# Altium schematic sheet Analog Front End.SchDoc
size A1
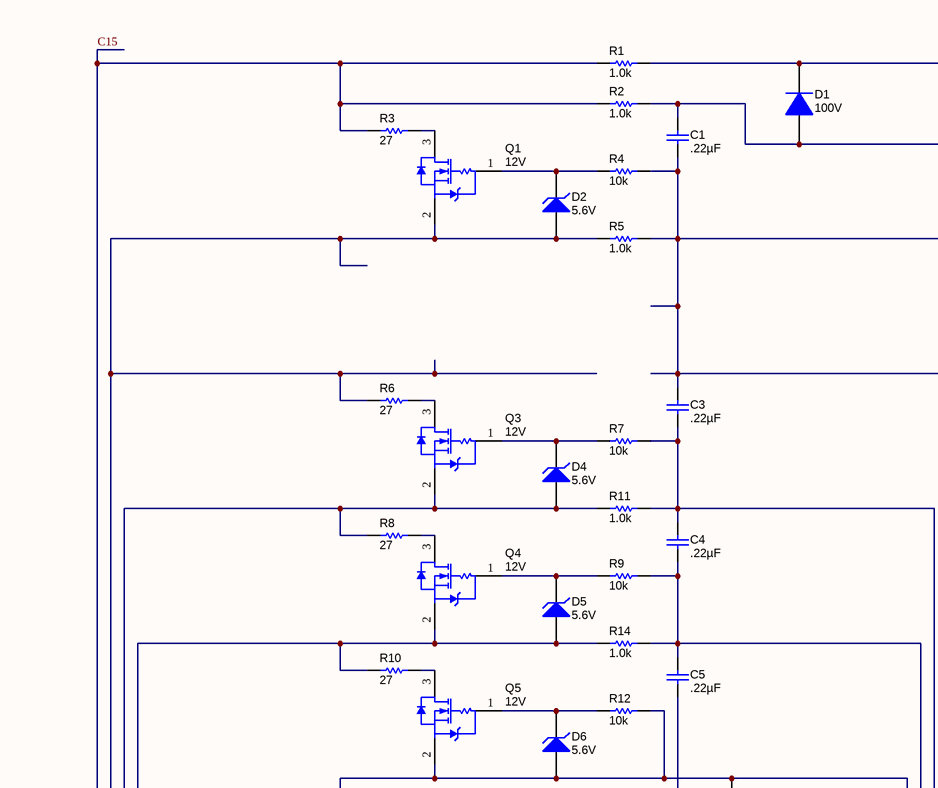
[diagram p0: Analog Front End.SchDoc, top left]
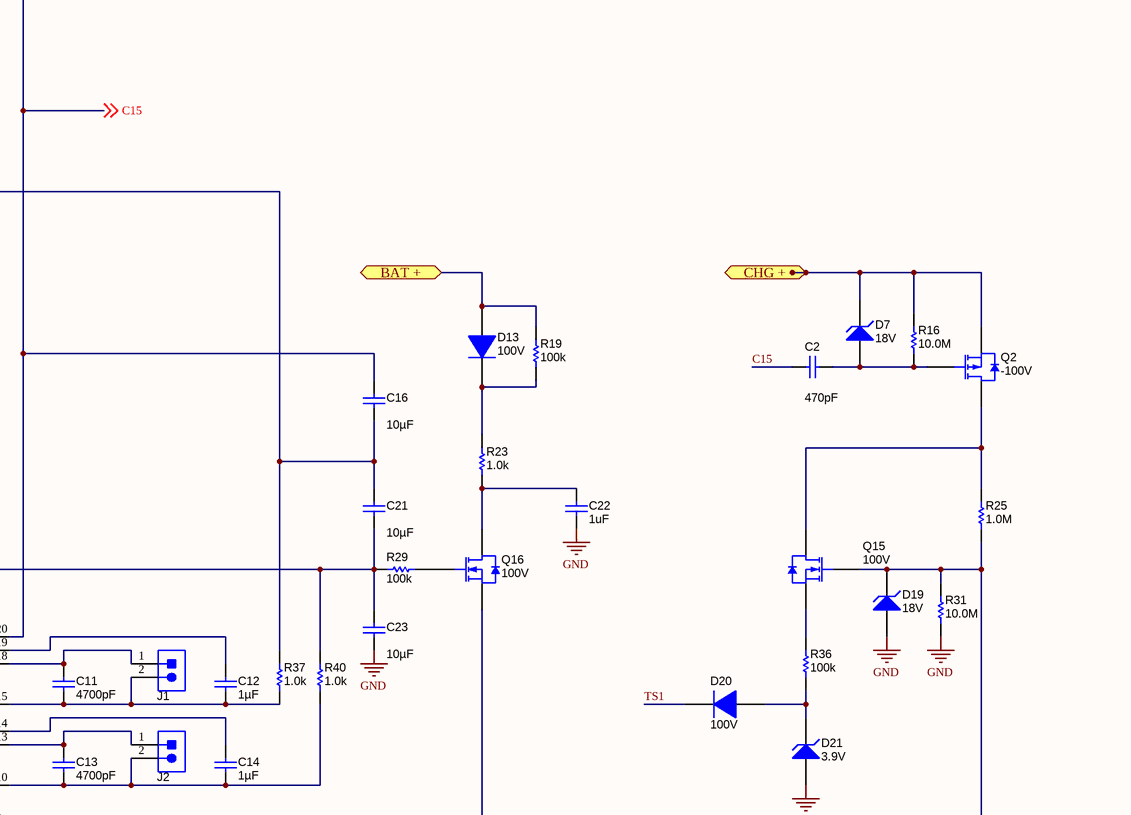
[diagram p1: Analog Front End.SchDoc, top right]
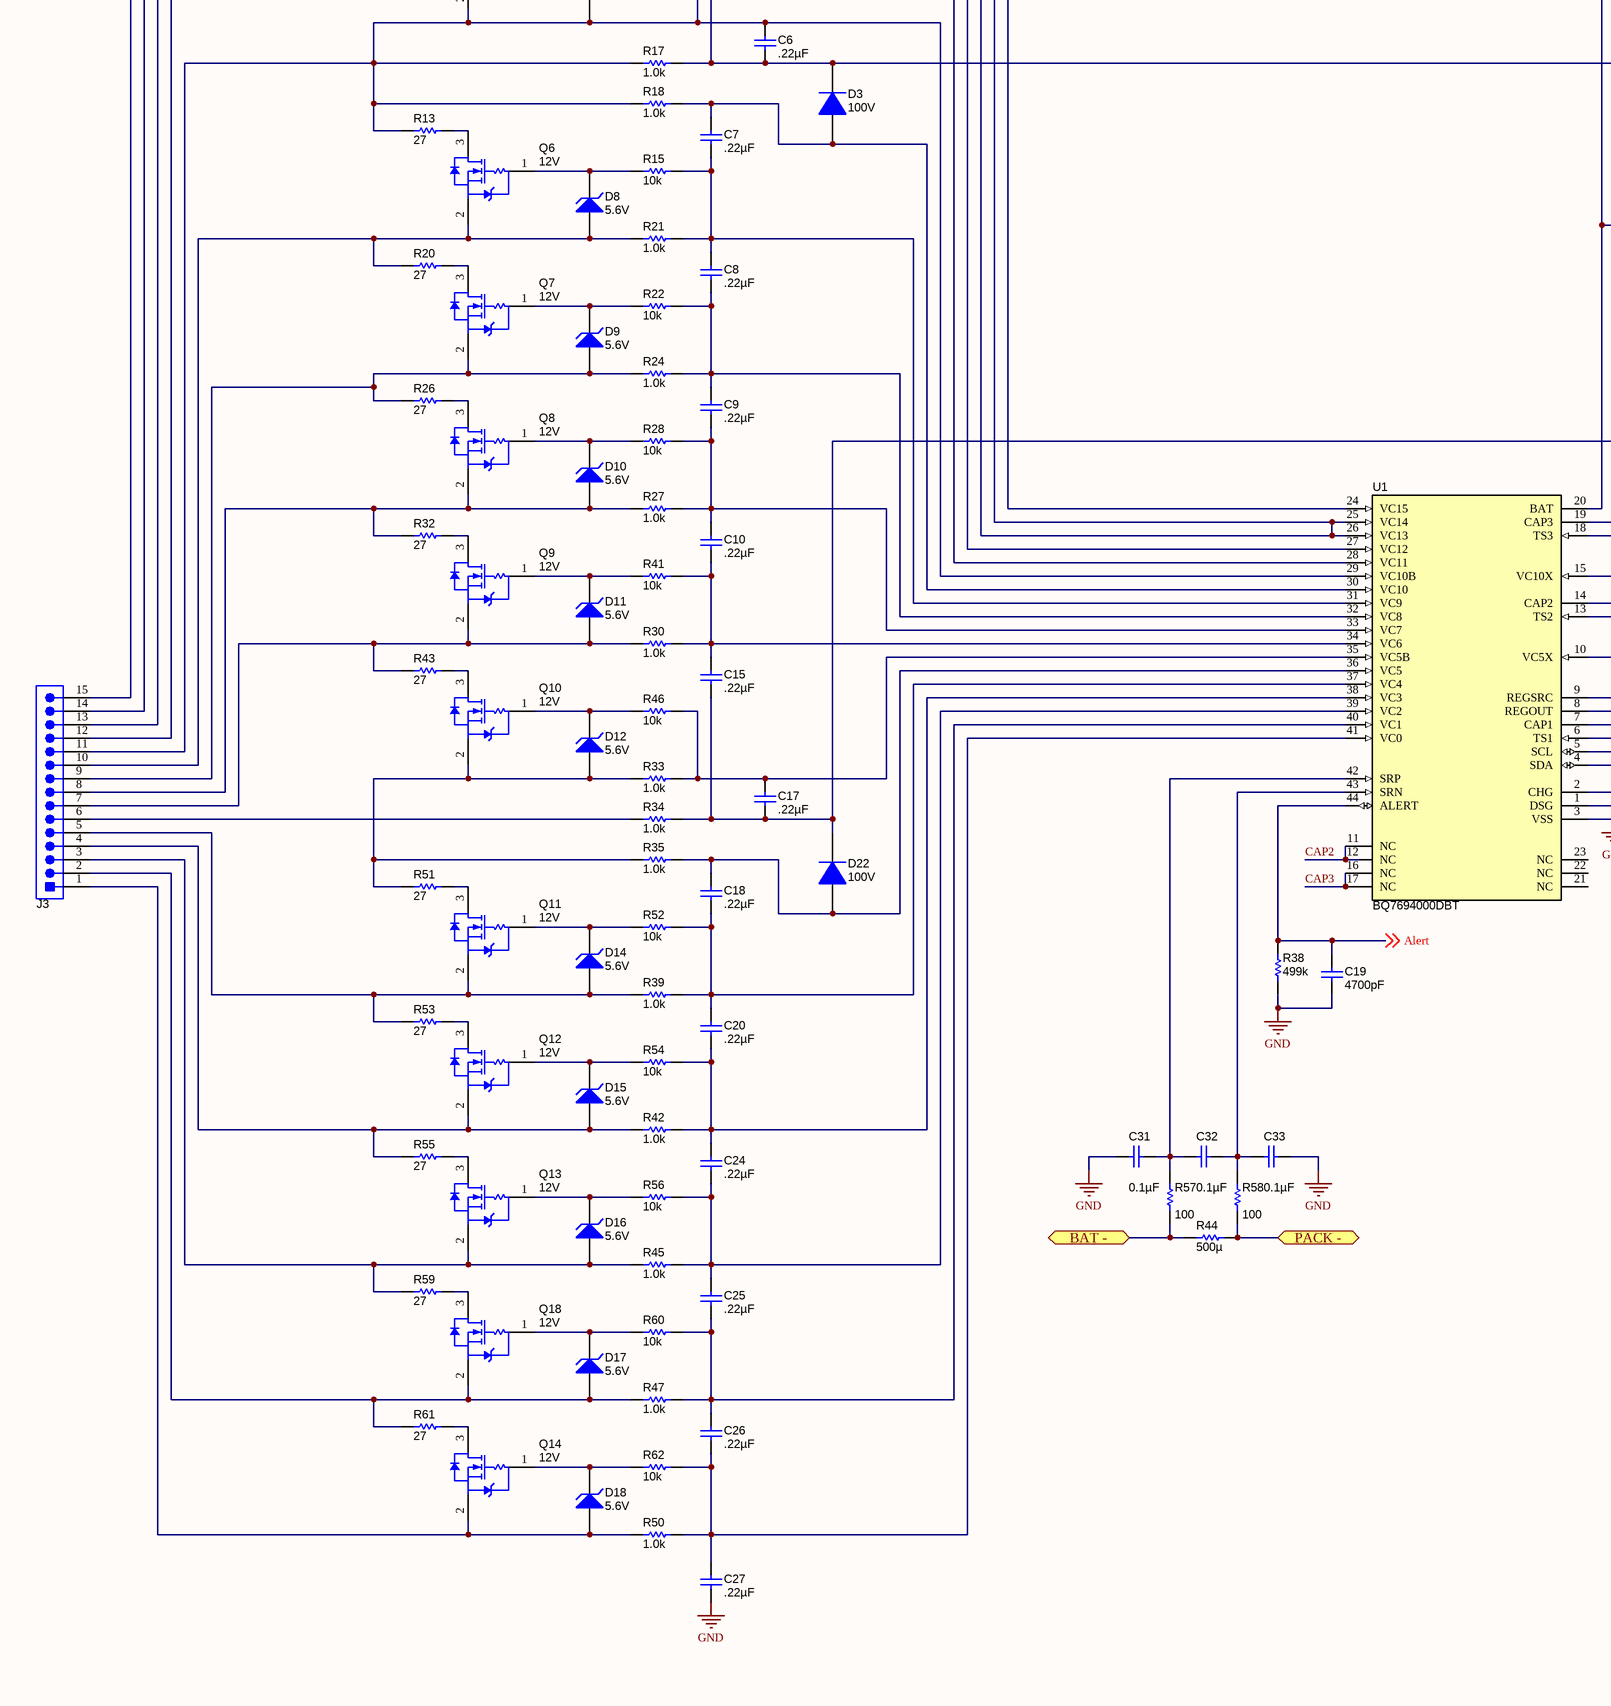
[diagram p2: Analog Front End.SchDoc, bottom left]
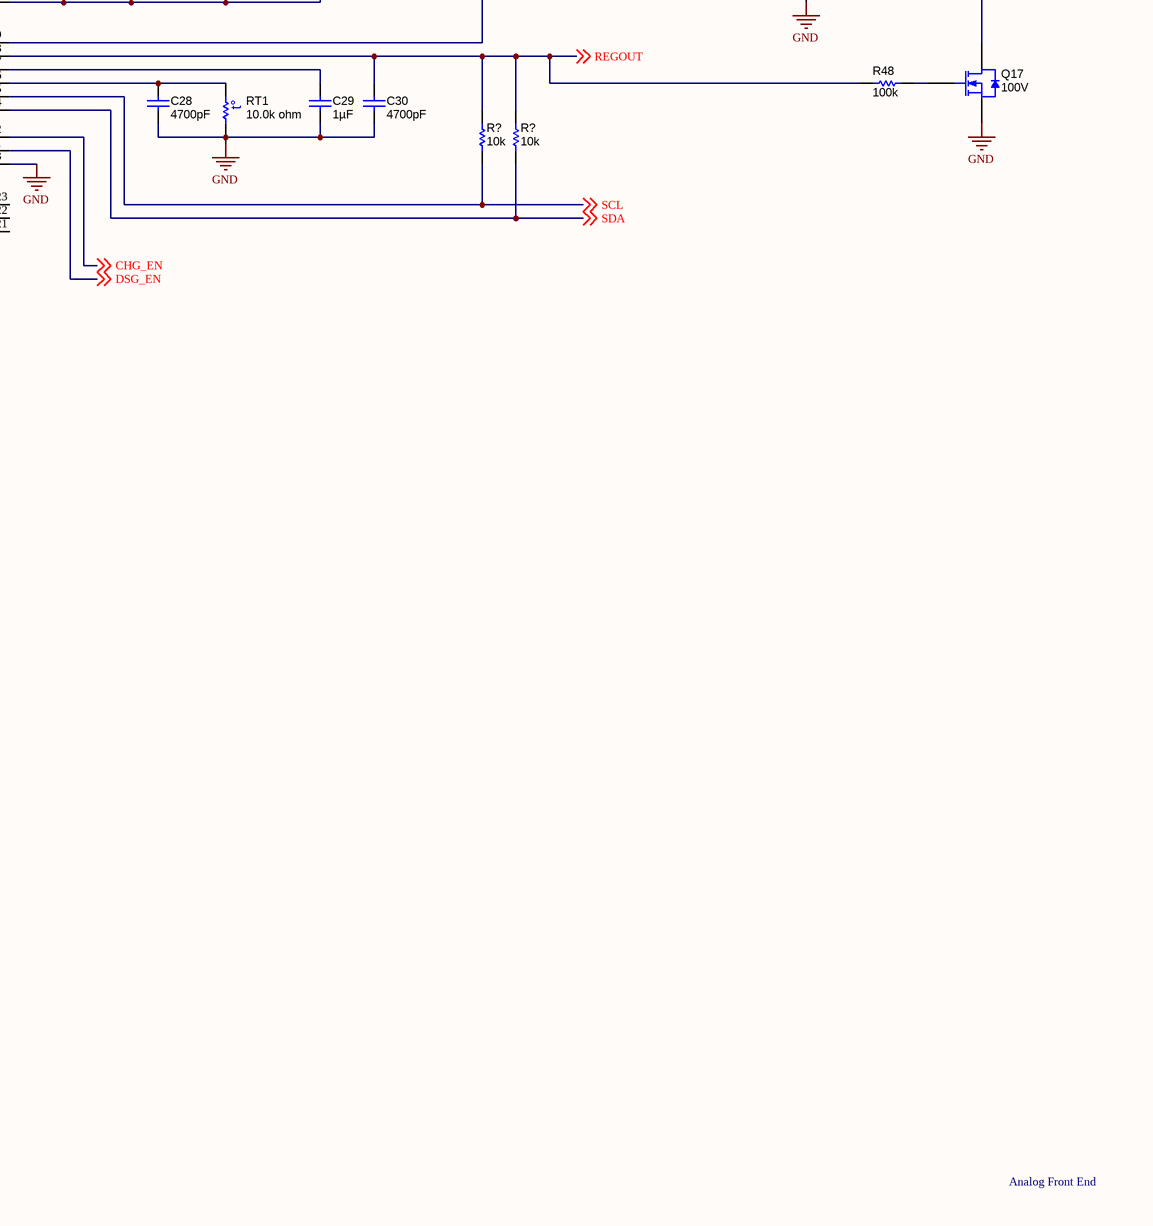
[diagram p3: Analog Front End.SchDoc, bottom right]

## Parts
(Parts that share a designator on the sheet are numbered #1, #2 ... from top to bottom, then left to right.)
C1  ValueDisplayed: .22µF  [CAP 0603/1608]  (hidden comment: CL10B224KA8NNNC)
C2  ValueDisplayed: 470pF  [CAP 0603/1608]  (hidden comment: CL10B471KB8WPNC)
C3  ValueDisplayed: .22µF  [CAP 0603/1608]  (hidden comment: CL10B224KA8NNNC)
C4  ValueDisplayed: .22µF  [CAP 0603/1608]  (hidden comment: CL10B224KA8NNNC)
C5  ValueDisplayed: .22µF  [CAP 0603/1608]  (hidden comment: CL10B224KA8NNNC)
C6  ValueDisplayed: .22µF  [CAP 0603/1608]  (hidden comment: CL10B224KA8NNNC)
C7  ValueDisplayed: .22µF  [CAP 0603/1608]  (hidden comment: CL10B224KA8NNNC)
C8  ValueDisplayed: .22µF  [CAP 0603/1608]  (hidden comment: CL10B224KA8NNNC)
C9  ValueDisplayed: .22µF  [CAP 0603/1608]  (hidden comment: CL10B224KA8NNNC)
C10  ValueDisplayed: .22µF  [CAP 0603/1608]  (hidden comment: CL10B224KA8NNNC)
C11  ValueDisplayed: 4700pF  [0603]  (hidden comment: 885012206087)
C12  ValueDisplayed: 1µF  [CAP 0603/1608]  (hidden comment: CL10B105KA8NNNC)
C13  ValueDisplayed: 4700pF  [0603]  (hidden comment: 885012206087)
C14  ValueDisplayed: 1µF  [CAP 0603/1608]  (hidden comment: CL10B105KA8NNNC)
C15  ValueDisplayed: .22µF  [CAP 0603/1608]  (hidden comment: CL10B224KA8NNNC)
C16  ValueDisplayed: 10µF  [CAP 1206/3216 - 1.8MM]  (hidden comment: CGA5L1X7R1V106K160AC)
C17  ValueDisplayed: .22µF  [CAP 0603/1608]  (hidden comment: CL10B224KA8NNNC)
C18  ValueDisplayed: .22µF  [CAP 0603/1608]  (hidden comment: CL10B224KA8NNNC)
C19  ValueDisplayed: 4700pF  [0603]  (hidden comment: 885012206087)
C20  ValueDisplayed: .22µF  [CAP 0603/1608]  (hidden comment: CL10B224KA8NNNC)
C21  ValueDisplayed: 10µF  [CAP 1206/3216 - 1.8MM]  (hidden comment: CGA5L1X7R1V106K160AC)
C22  ValueDisplayed: 1uF  [CAP 0603/1608]  (hidden comment: CL10B105KA8NNNC)
C23  ValueDisplayed: 10µF  [CAP 1206/3216 - 1.8MM]  (hidden comment: CGA5L1X7R1V106K160AC)
C24  ValueDisplayed: .22µF  [CAP 0603/1608]  (hidden comment: CL10B224KA8NNNC)
C25  ValueDisplayed: .22µF  [CAP 0603/1608]  (hidden comment: CL10B224KA8NNNC)
C26  ValueDisplayed: .22µF  [CAP 0603/1608]  (hidden comment: CL10B224KA8NNNC)
C27  ValueDisplayed: .22µF  [CAP 0603/1608]  (hidden comment: CL10B224KA8NNNC)
C28  ValueDisplayed: 4700pF  [CAP 0603/1608]  (hidden comment: CL10B472KC8WPNC)
C29  ValueDisplayed: 1µF  [CAP 0603/1608]  (hidden comment: CL10B105KA8NNNC)
C30  ValueDisplayed: 4700pF  [CAP 0603/1608]  (hidden comment: CL10B472KC8WPNC)
C31  ValueDisplayed: 0.1µF  [CAP 0603/1608]  (hidden comment: C1608X7R1H104K080AA)
C32  ValueDisplayed: 0.1µF  [CAP 0603/1608]  (hidden comment: C1608X7R1H104K080AA)
C33  ValueDisplayed: 0.1µF  [CAP 0603/1608]  (hidden comment: C1608X7R1H104K080AA)
D1  value 100V  [SOD123FA]  (hidden comment: S210FA)
D2  value 5.6V  [SOD323FL]  (hidden comment: MM3Z5V6C)
D3  value 100V  [SOD123FA]  (hidden comment: S210FA)
D4  value 5.6V  [SOD323FL]  (hidden comment: MM3Z5V6C)
D5  value 5.6V  [SOD323FL]  (hidden comment: MM3Z5V6C)
D6  value 5.6V  [SOD323FL]  (hidden comment: MM3Z5V6C)
D7  value 18V  [SOD-123]  (hidden comment: BZT52C18-E3-08)
D8  value 5.6V  [SOD323FL]  (hidden comment: MM3Z5V6C)
D9  value 5.6V  [SOD323FL]  (hidden comment: MM3Z5V6C)
D10  value 5.6V  [SOD323FL]  (hidden comment: MM3Z5V6C)
D11  value 5.6V  [SOD323FL]  (hidden comment: MM3Z5V6C)
D12  value 5.6V  [SOD323FL]  (hidden comment: MM3Z5V6C)
D13  value 100V  [SOD123FA]  (hidden comment: S210FA)
D14  value 5.6V  [SOD323FL]  (hidden comment: MM3Z5V6C)
D15  value 5.6V  [SOD323FL]  (hidden comment: MM3Z5V6C)
D16  value 5.6V  [SOD323FL]  (hidden comment: MM3Z5V6C)
D17  value 5.6V  [SOD323FL]  (hidden comment: MM3Z5V6C)
D18  value 5.6V  [SOD323FL]  (hidden comment: MM3Z5V6C)
D19  value 18V  [SOD-123]  (hidden comment: BZT52C18-E3-08)
D20  value 100V  [SOD123FA]  (hidden comment: S210FA)
D21  value 3.9V  [SOD323F]  (hidden comment: MM3Z3V9B)
D22  value 100V  [SOD123FA]  (hidden comment: S210FA)
J1  SWR25X-NRTC-S02-ST-BA  [SULLINS NRTC-S02]  (value not drawn)
J2  SWR25X-NRTC-S02-ST-BA  [SULLINS NRTC-S02]  (value not drawn)
J3  S15B-PH-SM4-TB(LF)(SN)  [JST S15B-PH-SM4-TB]  (value not drawn)
Q1  value 12V  [Femto (0402)]  (hidden comment: CSD13381F4)
Q2  value -100V  [SOT223]  (hidden comment: FQT5P10TF)
Q3  value 12V  [Femto (0402)]  (hidden comment: CSD13381F4)
Q4  value 12V  [Femto (0402)]  (hidden comment: CSD13381F4)
Q5  value 12V  [Femto (0402)]  (hidden comment: CSD13381F4)
Q6  value 12V  [Femto (0402)]  (hidden comment: CSD13381F4)
Q7  value 12V  [Femto (0402)]  (hidden comment: CSD13381F4)
Q8  value 12V  [Femto (0402)]  (hidden comment: CSD13381F4)
Q9  value 12V  [Femto (0402)]  (hidden comment: CSD13381F4)
Q10  value 12V  [Femto (0402)]  (hidden comment: CSD13381F4)
Q11  value 12V  [Femto (0402)]  (hidden comment: CSD13381F4)
Q12  value 12V  [Femto (0402)]  (hidden comment: CSD13381F4)
Q13  value 12V  [Femto (0402)]  (hidden comment: CSD13381F4)
Q14  value 12V  [Femto (0402)]  (hidden comment: CSD13381F4)
Q15  value 100V  [SOT323]  (hidden comment: BSS123WQ-7-FDICT-ND)
Q16  value 100V  [SOT323]  (hidden comment: BSS123WQ-7-FDICT-ND)
Q17  value 100V  [SOT323]  (hidden comment: BSS123WQ-7-FDICT-ND)
Q18  value 12V  [Femto (0402)]  (hidden comment: CSD13381F4)
R1  ValueDisplayed: 1.0k  [RES 0603/1608]  (hidden comment: ERJ-PB3D1001V)
R2  ValueDisplayed: 1.0k  [RES 0603/1608]  (hidden comment: ERJ-PB3D1001V)
R3  ValueDisplayed: 27  [RES 1206/3216]  (hidden comment: LTR18EZPF27R0)
R4  ValueDisplayed: 10k  [RES 0603/1608]  (hidden comment: ERJ-3EKF1002V)
R5  ValueDisplayed: 1.0k  [RES 0603/1608]  (hidden comment: ERJ-PB3D1001V)
R6  ValueDisplayed: 27  [RES 1206/3216]  (hidden comment: LTR18EZPF27R0)
R7  ValueDisplayed: 10k  [RES 0603/1608]  (hidden comment: ERJ-3EKF1002V)
R8  ValueDisplayed: 27  [RES 1206/3216]  (hidden comment: LTR18EZPF27R0)
R9  ValueDisplayed: 10k  [RES 0603/1608]  (hidden comment: ERJ-3EKF1002V)
R10  ValueDisplayed: 27  [RES 1206/3216]  (hidden comment: LTR18EZPF27R0)
R11  ValueDisplayed: 1.0k  [RES 0603/1608]  (hidden comment: ERJ-PB3D1001V)
R12  ValueDisplayed: 10k  [RES 0603/1608]  (hidden comment: ERJ-3EKF1002V)
R13  ValueDisplayed: 27  [RES 1206/3216]  (hidden comment: LTR18EZPF27R0)
R14  ValueDisplayed: 1.0k  [RES 0603/1608]  (hidden comment: ERJ-PB3D1001V)
R15  ValueDisplayed: 10k  [RES 0603/1608]  (hidden comment: ERJ-3EKF1002V)
R16  ValueDisplayed: 10.0M  [RES 0603/1608]  (hidden comment: RCS060310M0FKEA)
R17  ValueDisplayed: 1.0k  [RES 0603/1608]  (hidden comment: ERJ-PB3D1001V)
R18  ValueDisplayed: 1.0k  [RES 0603/1608]  (hidden comment: ERJ-PB3D1001V)
R19  ValueDisplayed: 100k  [RES 0603/1608]  (hidden comment: RCA0603100KJNEA)
R20  ValueDisplayed: 27  [RES 1206/3216]  (hidden comment: LTR18EZPF27R0)
R21  ValueDisplayed: 1.0k  [RES 0603/1608]  (hidden comment: ERJ-PB3D1001V)
R22  ValueDisplayed: 10k  [RES 0603/1608]  (hidden comment: ERJ-3EKF1002V)
R23  ValueDisplayed: 1.0k  [RES 0603/1608]  (hidden comment: ERJ-PB3D1001V)
R24  ValueDisplayed: 1.0k  [RES 0603/1608]  (hidden comment: ERJ-PB3D1001V)
R25  ValueDisplayed: 1.0M  [RES 0603/1608]  (hidden comment: CRCW06031M00JNEA)
R26  ValueDisplayed: 27  [RES 1206/3216]  (hidden comment: LTR18EZPF27R0)
R27  ValueDisplayed: 1.0k  [RES 0603/1608]  (hidden comment: ERJ-PB3D1001V)
R28  ValueDisplayed: 10k  [RES 0603/1608]  (hidden comment: ERJ-3EKF1002V)
R29  ValueDisplayed: 100k  [RES 0603/1608]  (hidden comment: RCA0603100KJNEA)
R30  ValueDisplayed: 1.0k  [RES 0603/1608]  (hidden comment: ERJ-PB3D1001V)
R31  ValueDisplayed: 10.0M  [RES 0603/1608]  (hidden comment: RCS060310M0FKEA)
R32  ValueDisplayed: 27  [RES 1206/3216]  (hidden comment: LTR18EZPF27R0)
R33  ValueDisplayed: 1.0k  [RES 0603/1608]  (hidden comment: ERJ-PB3D1001V)
R34  ValueDisplayed: 1.0k  [RES 0603/1608]  (hidden comment: ERJ-PB3D1001V)
R35  ValueDisplayed: 1.0k  [RES 0603/1608]  (hidden comment: ERJ-PB3D1001V)
R36  ValueDisplayed: 100k  [RES 0603/1608]  (hidden comment: RCA0603100KJNEA)
R37  ValueDisplayed: 1.0k  [RES 0603/1608]  (hidden comment: ERJ-PB3D1001V)
R38  ValueDisplayed: 499k  [RES 0603/1608]  (hidden comment: CRCW0603499KFKEA)
R39  ValueDisplayed: 1.0k  [RES 0603/1608]  (hidden comment: ERJ-PB3D1001V)
R40  ValueDisplayed: 1.0k  [RES 0603/1608]  (hidden comment: ERJ-PB3D1001V)
R41  ValueDisplayed: 10k  [RES 0603/1608]  (hidden comment: ERJ-3EKF1002V)
R42  ValueDisplayed: 1.0k  [RES 0603/1608]  (hidden comment: ERJ-PB3D1001V)
R43  ValueDisplayed: 27  [RES 1206/3216]  (hidden comment: LTR18EZPF27R0)
R44  ValueDisplayed: 500µ  [WSLP5931]  (hidden comment: WSLP5931L5000FEB)
R45  ValueDisplayed: 1.0k  [RES 0603/1608]  (hidden comment: ERJ-PB3D1001V)
R46  ValueDisplayed: 10k  [RES 0603/1608]  (hidden comment: ERJ-3EKF1002V)
R47  ValueDisplayed: 1.0k  [RES 0603/1608]  (hidden comment: ERJ-PB3D1001V)
R48  ValueDisplayed: 100k  [RES 0603/1608]  (hidden comment: RCA0603100KJNEA)
R50  ValueDisplayed: 1.0k  [RES 0603/1608]  (hidden comment: ERJ-PB3D1001V)
R51  ValueDisplayed: 27  [RES 1206/3216]  (hidden comment: LTR18EZPF27R0)
R52  ValueDisplayed: 10k  [RES 0603/1608]  (hidden comment: ERJ-3EKF1002V)
R53  ValueDisplayed: 27  [RES 1206/3216]  (hidden comment: LTR18EZPF27R0)
R54  ValueDisplayed: 10k  [RES 0603/1608]  (hidden comment: ERJ-3EKF1002V)
R55  ValueDisplayed: 27  [RES 1206/3216]  (hidden comment: LTR18EZPF27R0)
R56  ValueDisplayed: 10k  [RES 0603/1608]  (hidden comment: ERJ-3EKF1002V)
R57  value 100  [RES 0603/1608]  (hidden comment: ERJ-PA3J101V)
R58  value 100  [RES 0603/1608]  (hidden comment: ERJ-PA3J101V)
R59  ValueDisplayed: 27  [RES 1206/3216]  (hidden comment: LTR18EZPF27R0)
R60  ValueDisplayed: 10k  [RES 0603/1608]  (hidden comment: ERJ-3EKF1002V)
R61  ValueDisplayed: 27  [RES 1206/3216]  (hidden comment: LTR18EZPF27R0)
R62  ValueDisplayed: 10k  [RES 0603/1608]  (hidden comment: ERJ-3EKF1002V)
R?#1  ValueDisplayed: 10k  [RES 0603/1608]  (hidden comment: ERJ-3EKF1002V)
R?#2  ValueDisplayed: 10k  [RES 0603/1608]  (hidden comment: ERJ-3EKF1002V)
RT1  value 10.0k ohm  [NTC 0402/1005]  (hidden comment: NTCG103JF103FT1S)
U1  BQ7694000DBT  [TTSOP44_N V2]

## Ports
BAT + (bidir), BAT - (bidir), CHG + (in), PACK - (bidir)

## Nets
GND: C19.2 C22.2 C23.2 C27.2 C28.2 C29.2 C30.2 C31.2 C33.1 D19.2(A) D21.1(K) Q17.2(S) R31.1 R38.1 RT1.1 U1.3(VSS)
Alert: C19.1 R38.2 U1.44(ALERT) ; off-sheet Alert
BAT +: D13.2(A) R19.2 ; port BAT +
BAT -: R44.1 R57.1 ; port BAT -
C15: C2.2 C16.1 D1.1(K) J3.15 R1.1 R1.2 R2.1 R3.1 U1.20(BAT) ; off-sheet C15
CAP2: U1.11(NC) U1.12(NC)
CAP3: U1.16(NC) U1.17(NC)
CHG +: D7.1(K) Q2.2(S) R16.2 ; port CHG +
CHG_EN: U1.2(CHG) ; off-sheet CHG_EN
DSG_EN: U1.1(DSG) ; off-sheet DSG_EN
PACK -: R44.2 R58.1 ; port PACK -
REGOUT: C30.1 R48.2 R?#1.2 R?#2.2 U1.8(REGOUT) ; off-sheet REGOUT
SCL: R?#1.1 U1.5(SCL) ; off-sheet SCL
SDA: R?#2.1 U1.4(SDA) ; off-sheet SDA
TS1: D20.1(K)
NetC1_1: C1.1 D1.2(A) R2.2 U1.24(VC15)
NetC1_2: C1.2 C3.1 R4.1 R5.2 U1.25(VC14) U1.26(VC13)
NetC2_1: C2.1 D7.2(A) Q2.1(G) R16.1
NetC3_2: C3.2 C4.1 R7.1 R11.2 U1.27(VC12)
NetC4_2: C4.2 C5.1 R9.1 R14.2 U1.28(VC11)
NetC5_2: C5.2 C6.2 C16.2 C21.1 D3.1(K) R17.2 R37.1
NetC6_1: C6.1 D6.1(A) J3.11 Q5.2(S) R12.1 R13.1 R17.1 R18.1 U1.29(VC10B)
NetC7_1: C7.1 D3.2(A) R18.2 U1.30(VC10)
NetC7_2: C7.2 C8.1 R15.1 R21.2 U1.31(VC9)
NetC8_2: C8.2 C9.1 R22.1 R24.2 U1.32(VC8)
NetC9_2: C9.2 C10.1 R27.2 R28.1 U1.33(VC7)
NetC10_2: C10.2 C15.1 R30.2 R41.1 U1.34(VC6)
NetC11_1: C11.1 J1.1 U1.18(TS3)
NetC11_2: C11.2 C12.2 J1.2 R37.2 U1.15(VC10X)
NetC12_1: C12.1 U1.19(CAP3)
NetC13_1: C13.1 J2.1 U1.13(TS2)
NetC13_2: C13.2 C14.2 J2.2 R40.2 U1.10(VC5X)
NetC14_1: C14.1 U1.14(CAP2)
NetC15_2: C15.2 C17.2 C21.2 C23.1 D22.1(K) R29.1 R34.2 R40.1
NetC17_1: C17.1 R33.2 R46.1 U1.35(VC5B)
NetC18_1: C18.1 D22.2(A) R35.2 U1.36(VC5)
NetC18_2: C18.2 C20.1 R39.2 R52.1 U1.37(VC4)
NetC20_2: C20.2 C24.1 R42.2 R54.1 U1.38(VC3)
NetC22_1: C22.1 Q16.3(D) R23.2
NetC24_2: C24.2 C25.1 R45.2 R56.1 U1.39(VC2)
NetC25_2: C25.2 C26.1 R47.2 R60.1 U1.40(VC1)
NetC26_2: C26.2 C27.1 R50.2 R62.1 U1.41(VC0)
NetC28_1: C28.1 RT1.2 U1.6(TS1)
NetC29_1: C29.1 U1.7(CAP1)
NetC31_1: C31.1 C32.2 R57.2 U1.42(SRP)
NetC32_1: C32.1 C33.2 R58.2 U1.43(SRN)
NetD2_1: D2.1(A) J3.14 Q1.2(S) R5.1 R6.1
NetD2_2: D2.2(K) Q1.1(G) R4.2
NetD4_1: D4.1(A) J3.13 Q3.2(S) R8.1 R11.1
NetD4_2: D4.2(K) Q3.1(G) R7.2
NetD5_1: D5.1(A) J3.12 Q4.2(S) R10.1 R14.1
NetD5_2: D5.2(K) Q4.1(G) R9.2
NetD6_2: D6.2(K) Q5.1(G) R12.2
NetD8_1: D8.1(A) J3.10 Q6.2(S) R20.1 R21.1
NetD8_2: D8.2(K) Q6.1(G) R15.2
NetD9_1: D9.1(A) J3.9 Q7.2(S) R24.1 R26.1
NetD9_2: D9.2(K) Q7.1(G) R22.2
NetD10_1: D10.1(A) J3.8 Q8.2(S) R27.1 R32.1
NetD10_2: D10.2(K) Q8.1(G) R28.2
NetD11_1: D11.1(A) J3.7 Q9.2(S) R30.1 R43.1
NetD11_2: D11.2(K) Q9.1(G) R41.2
NetD12_1: D12.1(A) Q10.2(S) R33.1 R35.1 R51.1
NetD12_2: D12.2(K) Q10.1(G) R46.2
NetD13_1: D13.1(K) R19.1 R23.1
NetD14_1: D14.1(A) J3.5 Q11.2(S) R39.1 R53.1
NetD14_2: D14.2(K) Q11.1(G) R52.2
NetD15_1: D15.1(A) J3.4 Q12.2(S) R42.1 R55.1
NetD15_2: D15.2(K) Q12.1(G) R54.2
NetD16_1: D16.1(A) J3.3 Q13.2(S) R45.1 R59.1
NetD16_2: D16.2(K) Q13.1(G) R56.2
NetD17_1: D17.1(A) J3.2 Q18.2(S) R47.1 R61.1
NetD17_2: D17.2(K) Q18.1(G) R60.2
NetD18_1: D18.1(A) J3.1 Q14.2(S) R50.1
NetD18_2: D18.2(K) Q14.1(G) R62.2
NetD19_1: D19.1(K) Q15.1(G) Q17.3(D) R25.1 R31.2
NetD20_2: D20.2(A) D21.2(A) R36.1
NetJ3_6: J3.6 R34.1
NetQ1_3: Q1.3(D) R3.2
NetQ2_3: Q2.3(D) Q15.3(D) R25.2
NetQ3_3: Q3.3(D) R6.2
NetQ4_3: Q4.3(D) R8.2
NetQ5_3: Q5.3(D) R10.2
NetQ6_3: Q6.3(D) R13.2
NetQ7_3: Q7.3(D) R20.2
NetQ8_3: Q8.3(D) R26.2
NetQ9_3: Q9.3(D) R32.2
NetQ10_3: Q10.3(D) R43.2
NetQ11_3: Q11.3(D) R51.2
NetQ12_3: Q12.3(D) R53.2
NetQ13_3: Q13.3(D) R55.2
NetQ14_3: Q14.3(D) R61.2
NetQ15_2: Q15.2(S) R36.2
NetQ16_1: Q16.1(G) R29.2
NetQ16_2: Q16.2(S) U1.9(REGSRC)
NetQ17_1: Q17.1(G) R48.1
NetQ18_3: Q18.3(D) R59.2

Not connected (* = marked no-connect by the designer): U1 21(NC) 22(NC) 23(NC)

## Notes on the sheet
- Analog Front End
- (in symbol NTCG103JF103FT1S) t°

## Library data of the parts
C1 C3-C10 C15 C17 C18 C20 C24-C27 = CL10B224KA8NNNC: CAP CER 0.22uF 10% 25V X7R 0603; Manufacturer: Samsung Electro-Mechanics Inc.; Polarized: N; CompType: Capacitor; U/M: EA; Cap_F: 0.00000022; Tolerance_%: 10; Value1: Unknown; VDC_V: 25; TaMin_C: -55; TaMax_C: 125; Cap_Case: 0603; SizeArea_mm2: 1.28; SizeAreaWB_mm2: 4.68; SizeX_mm: 1.6; SizeY_mm: 0.8; SizeZ_mm: 1; AEC Category: Q200; SymbolVersion: 2008-07-09; Value: 0.22uF; PartNumber: CL10B224KA8NNNC; PackageReference: 0603; RoHS: Y; Value2: 0.22uF; MountType: SMT; Technology: Ceramic; TempCo: X7R; Published: 2008-06-19; Publisher: Texas Instruments; LatestRevisionDate: 2016-06-14; ComponentLink1Description: Datasheet link; ComponentLink1URL: http://www.samsungsem.com/kr/support/product-search/mlcc/CL10B105KA8NNNC.jsp; Supplier 1: Digikey; Supplier Part Number 1: 1276-1111-1-ND; AEC Qualified: N; AEC Grade: N/A
C2 = CL10B471KB8WPNC: CAP CER 470PF 10% 50V X7R 0603; Manufacturer: Samsung Electro-Mechanics America, Inc.; Polarized: N; CompType: Capacitor; U/M: EA; Cap_F: 0.00000000047; Tolerance_%: 10; Value1: Unknown; VDC_V: 50; TaMin_C: -55; TaMax_C: 125; Cap_Case: 0603; SizeArea_mm2: 1.28; SizeAreaWB_mm2: 4.68; SizeX_mm: 1.6; SizeY_mm: 0.8; SizeZ_mm: 1; AEC Category: Q200; SymbolVersion: 2008-07-09; Value: 470pF; PartNumber: CL10B471KB8WPNC; PackageReference: 0603; RoHS: Y; Value2: 50V; MountType: SMT; Technology: Ceramic; TempCo: X7R; Published: 2008-06-19; Publisher: Texas Instruments; LatestRevisionDate: 2016-06-14; ComponentLink1Description: Datasheet link; ComponentLink1URL: https://www.digikey.com/catalog/en/partgroup/cl-series-automotive/36790?mpart=CL10B471KB8WPNC&vendor=1276; AEC Qualified: N; AEC Grade: N/A; Supplier 1: Digi-Key; Supplier 2: Arrow; Supplier Part Number 1: 1276-6635-1-ND; Supplier Part Number 2: CL10B471KB8WPNC
C11 C13 C19 = 885012206087: CAP, CERM, 4700 pF, 50 V, +/- 10%, X7R, 0603; Manufacturer: Wurth Elektronik; Polarized: N; CompType: Capacitor; Value: 4700pF; U/M: EA; Cap_F: 0.0000000047; Tolerance_%: 10; Value1: Unknown; VDC_V: 50; Value2: 50V; TaMin_C: -55; TaMax_C: 125; SizeArea_mm2: 1.28; SizeAreaWB_mm2: 4.68; SizeX_mm: 1.6; SizeY_mm: 0.8; SizeZ_mm: 1; AEC Category: Q200; SymbolVersion: 2008-07-09; PartNumber: 885012206087; PackageReference: 0603; RoHS: Y; MountType: SMT; Technology: Ceramic; TempCo: X7R; Cap_Case: 0603; Published: 2008-06-19; Publisher: Texas Instruments; LatestRevisionDate: 2016-06-14; ComponentLink1Description: Datasheet link; ComponentLink1URL: http://katalog.we-online.de/pbs/datasheet/885012206087.pdf; Supplier 1: Mouser; Supplier Part Number 1: 710-885012206087; AEC Qualified: N; AEC Grade: N/A
C12 C14 C29 = CL10B105KA8NNNC: CAP CER 1UF 25V 10% X7R 0603; Manufacturer: Samsung Electro-Mechanics Inc.; Polarized: N; CompType: Capacitor; U/M: EA; Cap_F: 0.000001; Tolerance_%: 10; Value1: Unknown; VDC_V: 25; TaMin_C: -55; TaMax_C: 125; Cap_Case: 0603; SizeArea_mm2: 1.28; SizeAreaWB_mm2: 4.68; SizeX_mm: 1.6; SizeY_mm: 0.8; SizeZ_mm: 1; AEC Category: Q200; SymbolVersion: 2008-07-09; Value: 1uF; PartNumber: CL10B105KA8NNNC; PackageReference: 0603; RoHS: Y; Value2: 25V; MountType: SMT; Technology: Ceramic; TempCo: X7R; Published: 2008-06-19; Publisher: Texas Instruments; LatestRevisionDate: 2016-06-14; ComponentLink1Description: Datasheet link; ComponentLink1URL: http://www.samsungsem.com/kr/support/product-search/mlcc/CL10B105KA8NNNC.jsp; Supplier 1: Digikey; Supplier Part Number 1: 1276-1184-1-ND; AEC Qualified: N; AEC Grade: N/A
C16 C21 C23 = CGA5L1X7R1V106K160AC: CAP CER 10UF 35V X7R 1206; Manufacturer: TDK Corporation; Polarized: N; CompType: Capacitor; U/M: EA; Cap_F: 0.00001; Tolerance_%: 10; Value1: Unknown; VDC_V: 35; TaMin_C: -55; TaMax_C: 125; Cap_Case: 1206; SizeArea_mm2: 5.12; SizeAreaWB_mm2: 14.7; SizeX_mm: 3.2; SizeY_mm: 1.6; SizeZ_mm: 2.7; AEC Category: Q200; SymbolVersion: 2008-07-09; Value: 10uF; PartNumber: CGA5L1X7R1V106K160AC; PackageReference: 1206; RoHS: Y; Value2: 35V; MountType: SMT; Technology: Ceramic; TempCo: X7R; Published: 2008-06-19; Publisher: Texas Instruments; LatestRevisionDate: 2016-06-14; ComponentLink1Description: Datasheet link; ComponentLink1URL: https://product.tdk.com/info/en/catalog/datasheets/mlcc_automotive_general_en.pdf; AEC Qualified: ?; Supplier 1: Mouser; Supplier 2: Digi-Key; Supplier Part Number 1: 810-CGA5L1X7R1V106KC; Supplier Part Number 2: 445-174428-6-ND
C22 = CL10B105KA8NNNC: CAP CER 1uF 25V 10% X7R 0603; Manufacturer: Samsung Electro-Mechanics Inc.; Polarized: N; CompType: Capacitor; U/M: EA; Cap_F: 0.000001; Tolerance_%: 10; Value1: Unknown; VDC_V: 25; TaMin_C: -55; TaMax_C: 125; Cap_Case: 0603; SizeArea_mm2: 1.28; SizeAreaWB_mm2: 4.68; SizeX_mm: 1.6; SizeY_mm: 0.8; SizeZ_mm: 1; AEC Category: Q200; SymbolVersion: 2008-07-09; Value: 1uF; PartNumber: CL10B105KA8NNNC; PackageReference: 0603; RoHS: Y; Value2: 25V; MountType: SMT; Technology: Ceramic; TempCo: X7R; Published: 2008-06-19; Publisher: Texas Instruments; LatestRevisionDate: 2016-06-14; ComponentLink1Description: Datasheet link; ComponentLink1URL: http://www.samsungsem.com/kr/support/product-search/mlcc/CL10B105KA8NNNC.jsp; Supplier 1: Digikey; Supplier Part Number 1: 1276-1184-1-ND; AEC Qualified: N; AEC Grade: N/A
C28 C30 = CL10B472KC8WPNC: CAP CER 4700PF 10% 100V X7R 0603; Manufacturer: Samsung Electro-Mechanics America, Inc.; Polarized: N; CompType: Capacitor; U/M: EA; Cap_F: 0.0000000047; Tolerance_%: 10; Value1: Unknown; VDC_V: 100; TaMin_C: -55; TaMax_C: 125; Cap_Case: 0603; SizeArea_mm2: 1.28; SizeAreaWB_mm2: 4.68; SizeX_mm: 1.6; SizeY_mm: 0.8; SizeZ_mm: .35; AEC Category: Q200; SymbolVersion: 2008-07-09; Value: 4700pF; PartNumber: CL10B472KC8WPNC; PackageReference: 0603; RoHS: Y; Value2: 100V; MountType: SMT; Technology: Ceramic; TempCo: X7R; Published: 2008-06-19; Publisher: Texas Instruments; LatestRevisionDate: 2016-06-14; ComponentLink1Description: Datasheet link; ComponentLink1URL: http://www.samsungsem.com/kr/support/library/product-catalog/mlcc.jsp; Supplier 1: Digi-Key; Supplier Part Number 1: 1276-6584-1-ND; AEC Qualified: N; AEC Grade: N/A
C31-C33 = C1608X7R1H104K080AA: CAP, CERM, 0.1 µF, 50 V, +/- 10%, X7R, 0603; Manufacturer: TDK; Polarized: N; CompType: Capacitor; Value: 0.1uF; U/M: EA; Cap_F: 0.0000001; Tolerance_%: 10; ESR_ohm: 0.0296; Value1: 0.0296 ohm; VDC_V: 50; Value2: 50V; IRMS_A: 0.97199; TaMin_C: -55; TaMax_C: 125; Cap_Case: 0603; SizeArea_mm2: 1.28; SizeAreaWB_mm2: 4.68; SizeX_mm: 1.6; SizeY_mm: 0.8; SizeZ_mm: 1; AEC Category: Q200; SymbolVersion: 2008-07-09; PartNumber: C1608X7R1H104K080AA; PackageReference: 0603; RoHS: Y; MountType: SMT; Technology: Ceramic; TempCo: X7R; Published: 2008-06-19; Publisher: Texas Instruments; LatestRevisionDate: 2016-06-14; ComponentLink1Description: Datasheet link; ComponentLink1URL: https://product.tdk.com/en/search/capacitor/ceramic/mlcc/info?part_no=C1608X7R1H104K080AA; AEC Qualified: N; AEC Grade: N/A; Supplier 1: Digi-Key; Supplier 2: Mouser; Supplier Part Number 1: 445-1314-6-ND; Supplier Part Number 2: 810-C1608X7R1H104K
D1 D3 D13 D20 D22 = S210FA: DIODE SCHOTTKY 100V 2A SOD123FA; Manufacturer: Fairchild/ON Semiconductor; U/M: EA; Vf_V: .8; Io_A: 2; Vr_V: 100; Value2: .8V; TJmax_C: 150; Type: Ultrafast; ComponentLink1URL: https://www.fairchildsemi.com/datasheets/S2/S210FA.pdf; SymbolVersion: 2008-12-08; PackageReference: SOD-123FA; PartNumber: S210FA; ComponentLink1Description: Datasheet link; CompType: Diode; MountType: SMT; RoHS: Y; Value1: 2A; Published: 2008-06-26; Publisher: Texas Instruments; LatestRevisionDate: 2013-10-23; Supplier 1: Digi-Key; Supplier 2: Mouser; Supplier Part Number 1: S210FADKR-ND; Supplier Part Number 2: 512-S210FA
D2 D4-D6 D8-D12 D14-D18 = MM3Z5V6C: Diode, Zener, 5.6V, 200mW, SOD-323FL; Manufacturer: ON Semiconductor; U/M: EA; Power_W: 0.2; Vz_V: 5.6; Value1: 0.2W; RJA_CperW: 595; CompType: Zener; SymbolVersion: 2010-08-25; PartNumber: MM3Z5V6C; PackageReference: SOD-323FL; Vr_V: N/A; MountType: SMD; RoHS: Y; ComponentLink1Description: Datasheet link; ComponentLink1URL: http://www.onsemi.com/pub/Collateral/MM3Z9V1C-D.pdf; Published: 2008-10-08; Publisher: Texas Instruments; LatestRevisionDate: 2013-02-11; LatestRevisionNote: Updated Supplier Data; Supplier 1: Digi-Key; Supplier Part Number 1: MM3Z5V6CCT-ND; Supplier 2: Mouser; Supplier Part Number 2: 512-MM3Z5V6C
D7 D19 = BZT52C18-E3-08: DIODE ZENER 18V 5% 410MW SOD123; Manufacturer: Vishay Semiconductor Diodes Division; SymbolCreator: a0412235; U/M: EA; Power_W: .41; Vz_V: 18; Value1: 0.41W; RJA_CperW: 150; AEC Category: Q101; SymbolVersion: 2010-08-25; PartNumber: BZT52C18-E3-08; PackageReference: SOD-123; CompType: Zener; Vr_V: N/A; MountType: SMT; RoHS: Y; ComponentLink1Description: Datasheet link; ComponentLink1URL: http://www.vishay.com/docs/85760/bzt52.pdf; Published: 2008-10-08; Publisher: Texas Instruments; LatestRevisionDate: 2016-01-12; LatestRevisionNote: Updated Supplier Data; AEC Qualified: ?; Supplier 1: Digi-Key; Supplier 2: Mouser; Supplier Part Number 1: BZT52C18-E3-08GIDKR-ND; Supplier Part Number 2: 78-BZT52C18-E3-08
D21 = MM3Z3V9B: DIODE ZENER 3.9V 200MW SOD323F; Manufacturer: Fairchild/ON Semiconductor; SymbolCreator: a0412235; U/M: EA; Power_W: 0.2; Vz_V: 3.9; Value1: 0.2W; RJA_CperW: 595; AEC Category: Q101; SymbolVersion: 2010-08-25; PartNumber: MM3Z3V9B; PackageReference: SOD-323F; CompType: Zener; Vr_V: N/A; MountType: SMT; RoHS: Y; ComponentLink1Description: Datasheet link; ComponentLink1URL: https://www.fairchildsemi.com/datasheets/MM/MM3Z10VB.pdf; Published: 2008-10-08; Publisher: Texas Instruments; LatestRevisionDate: 2016-04-07; LatestRevisionNote: Updated Supplier Data; AEC Qualified: ?; Supplier 1: Digi-Key; Supplier Part Number 1: MM3Z3V9BDKR-ND
J1 J2 = SWR25X-NRTC-S02-ST-BA: HEADER HDR .100" SNGL PCB 2POS F-LOCK; Manufacturer: Sullins Connector Solutions; SymbolCreator: a0412235; Pitch_mm: 2.54; Shrouded: Y; SymbolVersion: 2013-08-30; PartNumber: SWR25X-NRTC-S02-ST-BA; PackageReference: 2x1 R/A Header; CompType: Header; RoHS: Y; MountType: TH; ComponentLink1Description: Datasheet URL; ComponentLink1URL: https://media.digikey.com/PDF/Data%20Sheets/Sullins%20PDFs/SWR25X-NRTC-Sxx-ST-BA.pdf; PinCount: 2; Publisher: Texas Instruments; LatestRevisionDate: 2016-07-20; Supplier 1: Digi-Key; Supplier Part Number 1: S9407-ND
J3 = S15B-PH-SM4-TB(LF)(SN): CONN HEADER PH SIDE 15POS 2MM; Manufacturer: JST Sales America Inc.; CompType: Terminal Block; U/M: EA; SymbolVersion: 2013-12-22; PartNumber: S15B-PH-SM4-TB(LF)(SN); PackageReference: 33.9x7.6x5.5 mm; RoHS: Y; MountType: SMT; ComponentLink1Description: Datasheet Link; ComponentLink1URL: http://www.jst-mfg.com/product/pdf/eng/ePH.pdf; Publisher: Texas Instruments; LatestRevisionDate: 2015-02-18; Supplier 1: Digi-Key; Supplier Part Number 1: 455-1761-1-ND
Q1 Q3-Q14 Q18 = CSD13381F4: MOSFET, N/P-CH, 12 V, 2.1 A, 1.0x0.35x0.6mm; Manufacturer: Texas Instruments; Alternate Manufacturer: None; SymbolCreator: a0411947; U/M: EA; ChType: N; VdsMax_V: 12; Value1: 0.14 ohm; Rdson45_ohm: 0.14; Value2: 1.06 nC; QgTyp_nC: 1.06; Vgs_V: 8; IdsMax_A: 2.1; SymbolVersion: 2013-11-21; PartNumber: CSD13381F4; PackageReference: 1.0x0.35x0.6mm; CompType: MOSFET; RoHS: Y; MountType: SMT; Published: 2008-06-19; Publisher: Texas Instruments; LatestRevisionDate: 2015-02-19; LatestRevisionNote: Added parts.; ComponentLink1Description: Datasheet link; ComponentLink1URL: http://www.ti.com/lit/ds/symlink/csd13381f4.pdf; Supplier 1: Digi-Key; Supplier Part Number 1: 296-38912-6-ND; Supplier 2: Newark; Supplier Part Number 2: 11X3112; Supplier 3: Mouser; Supplier Part Number 3: 595-CSD13381F4
Q2 = FQT5P10TF: MOSFET P-CH -100V -1A SOT-223; Manufacturer: Fairchild/ON Semiconductor; Alternate Manufacturer: None; U/M: EA; ChType: P; VdsMax_V: -100; Value1: 1.05 ohm; Rdson45_Ohm: 1.05; Value2: 8.2 nC; QgTyp_nC: 8.2; Vgs_V: -4; IdsMax_A: -1; SymbolVersion: 2008-07-09; PartNumber: FQT5P10TF; PackageReference: SOT-223; CompType: MOSFET; RoHS: Y; MountType: SMT; Published: 2008-06-19; Publisher: Texas Instruments; LatestRevisionDate: 2013-10-21; LatestRevisionNote: Added parts.; ComponentLink1Description: Datasheet link; ComponentLink1URL: https://www.fairchildsemi.com/datasheets/FQ/FQT5P10.pdf; Supplier 1: Digi-Key; Supplier 2: Mouser; Supplier Part Number 1: FQT5P10TFCT-ND; Supplier Part Number 2: 512-FQT5P10TF
Q15-Q17 = BSS123WQ-7-FDICT-ND: MOSFET N-CH 100V 0.17A SOT323; Manufacturer: Diodes Incorporated; Alternate Manufacturer: None; U/M: EA; ChType: N; VdsMax_V: 100; Value1: 6 ohm; Rdson45_Ohm: 10; Vgs_V: 20; IdsMax_A: 0.17; SymbolVersion: 2008-07-28; CompType: MOSFET; PartNumber: BSS123WQ-7-FDICT-ND; PackageReference: SOT-323; RoHS: Y; MountType: SMT; Published: 2008-06-19; Publisher: Texas Instruments; LatestRevisionDate: 2013-10-21; LatestRevisionNote: Added parts.; ComponentLink1Description: Datasheet link; ComponentLink1URL: https://www.diodes.com/assets/Datasheets/BSS123WQ.pdf; Supplier 1: Digi-Key; Supplier Part Number 1: BSS123WQ-7-FDICT-ND
R1 R2 R5 R11 R14 R17 R18 R21 R23 R24 R27 R30 R33-R35 R37 R39 R40 R42 R45 R47 R50 = ERJ-PB3D1001V: RES SMD 1K OHM 0.5% 1/5W 0603; Manufacturer: Panasonic Electronic Components; CompType: Resistor; Value: 1.0k; Res_ohm: 1000; Value_Code: 1k00; Tolerance_%: .5; Power_W: .2W; VDC_V: 400; TempCo: 50 ppm/C; SizeArea_mm2: 1.28; SizeX_mm: 1.6; SizeY_mm: .8; SizeZ_mm: .55; EIA_Code: E24; U/M: EA; AEC Category: Q200; AEC Qualified: Y; AEC Grade: 0; SymbolVersion: 2009-05-29; PartNumber: ERJ-PB3D1001V; PackageReference: 0603; RoHS: Y; Value1: 0.5%; Value2: .2W; MountType: SMT; Technology: Thick Film; Published: 2008-06-26; Publisher: Texas Instruments; LatestRevisionDate: 2016-06-10; ComponentLink1Description: Datasheet link; ComponentLink1URL: https://industrial.panasonic.com/cdbs/www-data/pdf/RDM0000/AOA0000C328.pdf; Supplier 3: Digi-Key; Supplier Part Number 3: P20283CT-ND
R3 R6 R8 R10 R13 R20 R26 R32 R43 R51 R53 R55 R59 R61 = LTR18EZPF27R0: RES SMD 27 OHM 1% 3/4W 1206 WIDE; Manufacturer: Rohm Semiconductor; CompType: Resistor; Value: 27; Tolerance_%: 1; Power_W: .75; Value2: .75W; VDC_V: 200; TempCo: 200 ppm/C; EIA_Code: E24; U/M: EA; SymbolVersion: 2009-05-29; PartNumber: LTR18EZPF27R0; PackageReference: 1206; RoHS: Y; Value1: 1%; MountType: SMT; Technology: Thick Film; LatestRevisionDate: 2015-04-13; ComponentLink1Description: Datasheet link; ComponentLink1URL: http://www.rohm.com/web/global/datasheet/LTR100JZPD/ltr-e; Supplier 1: Digi-Key; Supplier Part Number 1: RHM27YCT-ND; Published: 2008-06-26; Res_ohm: 27; Value_Code: 27
R4 R7 R9 R12 R15 R22 R28 R41 R46 R52 R54 R56 R60 R62 R?#1 R?#2 = ERJ-3EKF1002V: RES SMD 10K OHM 1% 1/10W 0603; Manufacturer: Panasonic Electronic Components; CompType: Resistor; Res_ohm: 10000; Value_Code: 10k0; Tolerance_%: 5; Value1: 5%; Power_W: 0.1; Value2: 0.1W; VDC_V: 75; TempCo: 100 ppm/C; EIA_Code: E24; U/M: EA; SymbolVersion: 2009-05-29; Value: 10k; PartNumber: ERJ-3EKF1002V; PackageReference: 0603; RoHS: Y; MountType: SMT; Technology: Thick Film; Published: 2008-06-26; Publisher: Texas Instruments; LatestRevisionDate: 2015-04-06; ComponentLink1Description: Datasheet link; ComponentLink1URL: http://industrial.panasonic.com/www-cgi/jvcr13pz.cgi?E+PZ+3+AOA0002+ERJ3EKF1002V+7+WW; Supplier 1: Digi-Key; Supplier Part Number 1: P10.0KHCT-ND; Supplier 2: Mouser; Supplier 3: Farnell
R16 R31 = RCS060310M0FKEA: RES SMD 10M OHM 1% 1/4W 0603; Manufacturer: Vishay-Dale; CompType: Resistor; Value: 10.0Meg; Res_ohm: 10000000; Value_Code: 10M0; Tolerance_%: 1; Power_W: 0.25; Value2: 0.25W; VDC_V: 75; TempCo: 100 ppm/C; EIA_Code: E96; U/M: EA; AEC Category: Q200; SymbolVersion: 2009-05-29; PartNumber: RCS060310M0FKEA; PackageReference: 0603; RoHS: Y; Value1: 1%; MountType: SMT; Technology: Thick Film; Published: 2008-06-26; Publisher: Texas Instruments; LatestRevisionDate: 2016-04-07; ComponentLink1Description: Datasheet link; ComponentLink1URL: http://www.vishay.com/docs/20065/rcse3.pdf; AEC Qualified: ?; Supplier 1: Digi-Key; Supplier 2: Mouser; Supplier Part Number 1: 541-2804-6-ND; Supplier Part Number 2: 71-RCS060310M0FKEA
R19 R29 R36 R48 = RCA0603100KJNEA: RES SMD 100K OHM 5% 1/10W 0603; Manufacturer: Vishay-Dale; CompType: Resistor; Res_ohm: 100000; Tolerance_%: 5; Power_W: 0.1; Value2: 0.1W; VDC_V: 75; TempCo: 200 ppm/C; EIA_Code: E24; U/M: EA; AEC Category: Q200; SymbolVersion: 2009-05-29; Value: 100k; PartNumber: RCA0603100KJNEA; PackageReference: 0603; RoHS: Y; Value_Code: 100k; Value1: 5%; MountType: SMT; Technology: Thick Film; Published: 2008-06-26; Publisher: Texas Instruments; LatestRevisionDate: 2016-04-07; ComponentLink1Description: Datasheet link; ComponentLink1URL: http://www.vishay.com/docs/20037/rcae3.pdf; Supplier 1: Digi-Key; Supplier Part Number 1: 541-2215-6-ND; AEC Qualified: ?
R25 = RCS06031M00FKEA: RES SMD 1M OHM 1% 1/4W 0603; Manufacturer: Vishay-Dale; CompType: Resistor; Value: 1.0Meg; Res_ohm: 1000000; Value_Code: 1M00; Tolerance_%: 5; Power_W: 0.25; Value2: 0.25W; VDC_V: 75; TempCo: 200 ppm/C; EIA_Code: E24; U/M: EA; AEC Category: Q200; SymbolVersion: 2009-05-29; PartNumber: CRCW06031M00JNEA; PackageReference: 0603; RoHS: Y; Value1: 1%; MountType: SMT; Technology: Thick Film; Published: 2008-06-26; Publisher: Texas Instruments; LatestRevisionDate: 2016-04-07; ComponentLink1Description: Datasheet link; ComponentLink1URL: http://www.vishay.com/docs/20065/rcse3.pdf; AEC Qualified: ?; Supplier 1: Digi-Key; Supplier Part Number 1: P10.0KHDKR-ND; Supplier 2: Mouser; Supplier Part Number 2: 71-RCS06031M00FKEA
R38 = CRCW0603499KFKEA: RES, 499 k, 1%, 0.1 W, 0603; Manufacturer: Vishay-Dale; CompType: Resistor; Value: 499k; Res_ohm: 499000; Tolerance_%: 1; Power_W: 0.1; Value2: 0.1W; VDC_V: 75; TempCo: 100 ppm/C; EIA_Code: E96; U/M: EA; SymbolVersion: 2009-05-29; PartNumber: CRCW0603499KFKEA; PackageReference: 0603; RoHS: Y; Value_Code: 499k; Value1: 1%; MountType: SMT; Technology: Thick Film; Published: 2008-06-26; Publisher: Texas Instruments; LatestRevisionDate: 2015-04-06; ComponentLink1Description: Datasheet link; ComponentLink1URL: http://www.vishay.com/docs/20035/dcrcwe3.pdf; Supplier 1: Digi-Key; Supplier Part Number 1: 541-499KHCT-ND; Supplier 2: Mouser; Supplier Part Number 2: 71-CRCW0603-499K-E3; Supplier 3: Farnell; Supplier Part Number 3: 1152042
R44 = WSLP5931L5000FEB: RES SMD 500 µOHM 1% 10W 5931; Manufacturer: Vishay Dale; CompType: Resistor; Value: 500µ; Tolerance_%: 1; Power_W: 10; VDC_V: 200; TempCo: 200 ppm/C; EIA_Code: 481; U/M: EA; Res_Ohm: .0005; SymbolVersion: 2009-05-29; PartNumber: WSLP5931L5000FEB; PackageReference: WSLP; RoHS: Y; Value1: 1%; Value2: 10W; MountType: SMD; Technology: Thick Film; LatestRevisionDate: 2015-04-13; ComponentLink1Description: Datasheet link; ComponentLink1URL: http://www.vishay.com/docs/30176/wslp3921.pdf; Supplier 1: Digi-Key; Supplier Part Number 1: WSLPD-.0005CT-ND; Published: 2008-06-26; Value_Code: 500µ
R57 R58 = ERJ-PA3J101V: RES SMD 100 OHM 5% 1/4W 0603; Manufacturer: Panasonic Electronic Components; CompType: Resistor; Value_Code: 100R; Tolerance_%: 5; Power_W: 0.125; Value2: 0.125W; VDC_V: 150; TempCo: 200 ppm/C; EIA_Code: E96; U/M: EA; SymbolVersion: 2009-05-29; PartNumber: ERJ-PA3J101V; PackageReference: 0603; RoHS: Y; Res_ohm: 100; Value1: 5%; MountType: SMT; Technology: Thick Film; Published: 2008-06-26; Publisher: Texas Instruments; LatestRevisionDate: 2013-01-08; ComponentLink1Description: Datasheet link; ComponentLink1URL: https://media.digikey.com/pdf/Data%20Sheets/Panasonic%20Resistors%20Thermistors%20PDFs/ERJ-PA3_Series_NPI.pdf; Supplier 1: Digi-Key; Supplier Part Number 1: P100BZDKR-ND
RT1 = NTCG103JF103FT1S: NTC Thermistor 10k 1% 0402 (1005 Metric); Manufacturer: TDK Corporation; CompType: ThermistorNTC; Tolerance_%: 1; Power_W: 0.125; TaMin_C: -40; TaMax_C: 150; U/M: EA; ComponentLink1URL: https://product.tdk.com/info/en/catalog/datasheets/503022/tpd_automotive_ntc-thermistor_ntcg_en.pdf; PackageReference: 0402; SymbolVersion: 2008-11-25; PartNumber: NTCG103JF103FT1S; ComponentLink1Description: Datasheet link; Series: NTCG; MountType: SMT; RoHS: Y; Published: 2009-09-22; Publisher: Texas Instruments; LatestRevisionDate: 2013-08-16; Supplier 1: Digi-Key; Supplier Part Number 1: 445-174506-1-ND; Supplier 2: Mouser; Supplier Part Number 2: 810-NTCG103JF103FT1S
U1 = BQ7694000DBTR: Battery Monitor for Lithium-Ion and Phosphate Battery Packs, DBT0044A; Manufacturer: Texas Instruments; SymbolCreator: a0412235; CompType: IC; U/M: EA; SymbolVersion: 2012-12-21; PartNumber: BQ7694000DBTR; Alternate PartNumber: BQ7694000DBT; PackageReference: DBT0044A; MountType: SMT; ComponentLink1Description: Datasheet Link; ComponentLink1URL: http://www.ti.com/lit/gpn/bq76920; RoHS: Y; Publisher: Texas Instruments; LatestRevisionDate: 2016-02-12; Alternate Manufacturer: Texas Instruments